# Altium schematic sheet Connectors.SchDoc: Gimbal - Connectors
size Letter; DrawnBy: Jing Hao Yao & Aidan Gratton; Organization: UW Robotics; Address1: 200 University Avenue; Address2: Waterloo; Address3: Ontario; Address4: Canada N2L 3G6; SheetNumber: 3; SheetTotal: 5
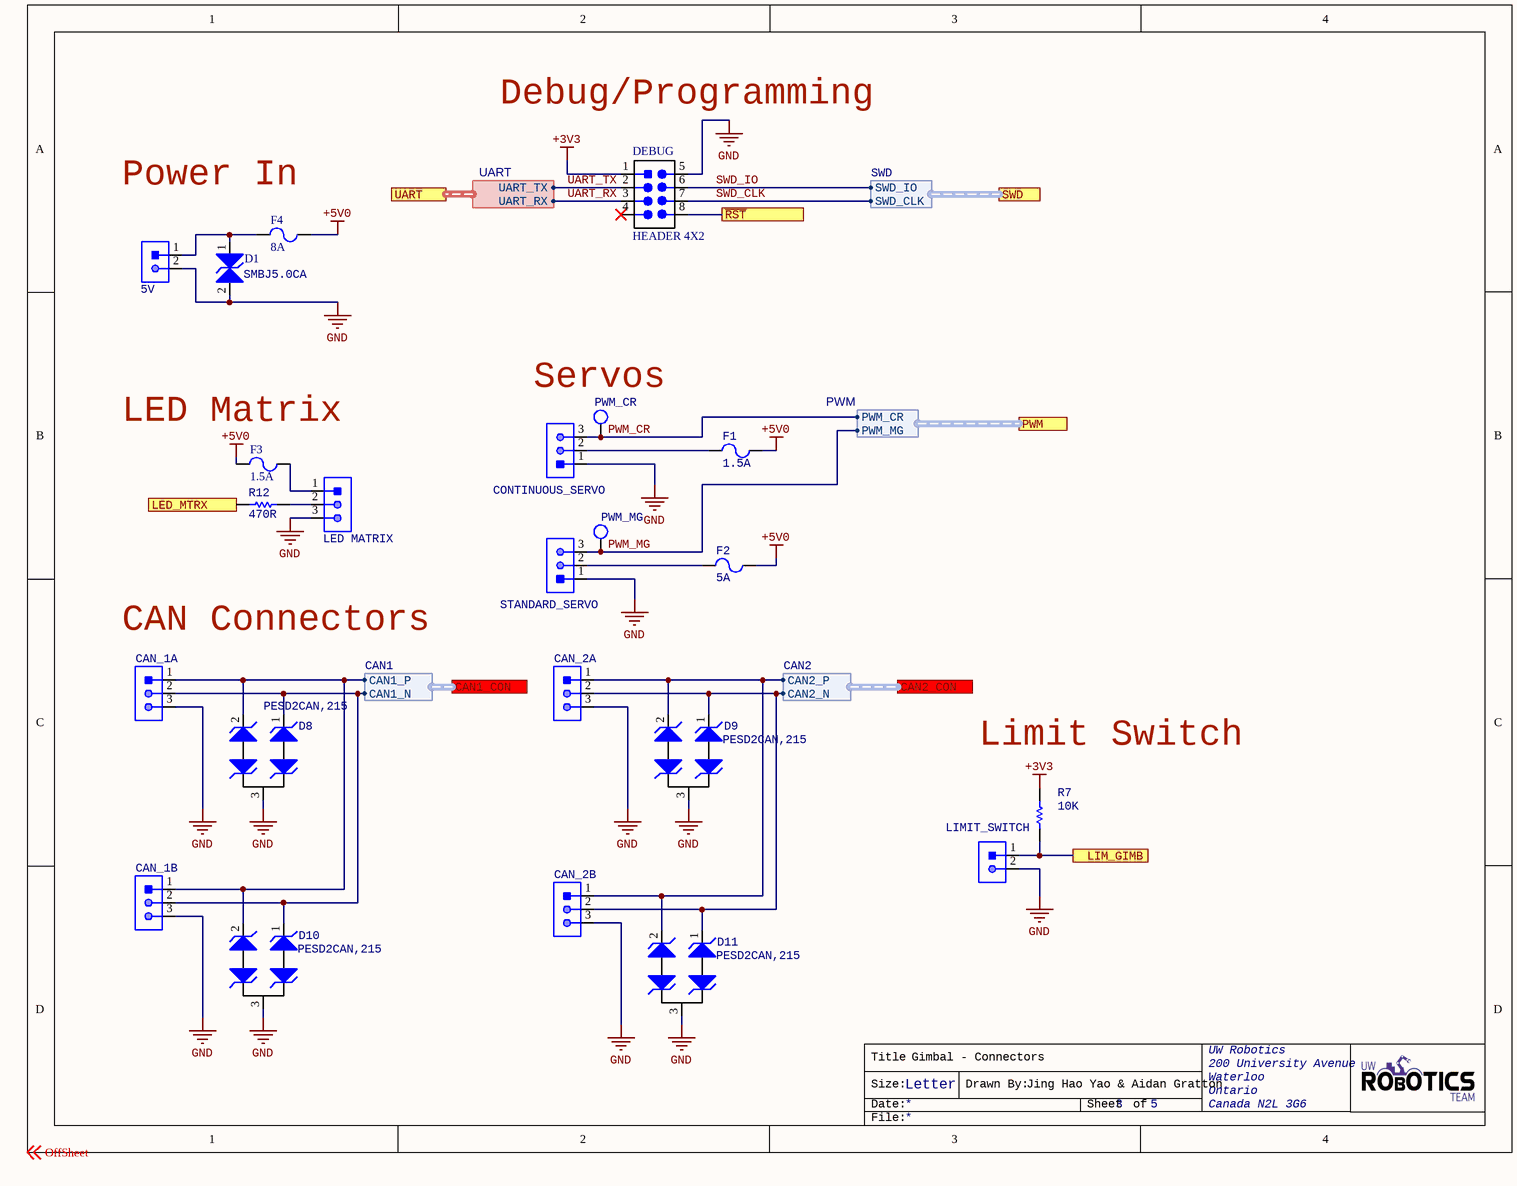
[diagram p0: Connectors.SchDoc]

## Parts
5V  CON_2M_SM4  [JST-B2B-SM4-TB]  (value not drawn)
CAN_1A  CON_3M_SM4  [JST-B3B-SM4-TB]  (value not drawn)
CAN_1B  CON_3M_SM4  [JST-B3B-SM4-TB]  (value not drawn)
CAN_2A  CON_3M_SM4  [JST-B3B-SM4-TB]  (value not drawn)
CAN_2B  CON_3M_SM4  [JST-B3B-SM4-TB]  (value not drawn)
CONTINUOUS_SERVO  CON_3M_SM4  [JST-B3B-SM4-TB]  (value not drawn)
D1  Manufacturer Part Number 1: SMBJ5.0CA  [TVS_DIODE_BIDIRECTIONAL]  (hidden comment: TVS_DIODE_BIDIRECTIONAL)
D8  Manufacturer Part Number: PESD2CAN,215  [TVS_DIODE_CAN]  (hidden comment: TVS_DIODE_CAN)
D9  Manufacturer Part Number: PESD2CAN,215  [TVS_DIODE_CAN]  (hidden comment: TVS_DIODE_CAN)
D10  Manufacturer Part Number: PESD2CAN,215  [TVS_DIODE_CAN]  (hidden comment: TVS_DIODE_CAN)
D11  Manufacturer Part Number: PESD2CAN,215  [TVS_DIODE_CAN]  (hidden comment: TVS_DIODE_CAN)
DEBUG  HEADER 4X2  [HEADER_2X4]
F1  Current Rating: 1.5A  [FUSE_0603]  (hidden comment: FUSE_1.5A_0603)
F2  Current Rating: 5A  [FUSE_0603]  (hidden comment: FUSE_5A_0603)
F3  Current Rating: 1.5A  [FUSE_0603]  (hidden comment: FUSE_1.5A_0603)
F4  Current Rating: 8A  [FUSE_0603]  (hidden comment: FUSE_8A_0603)
LED_MATRIX  CON_3M_SM4  [JST-B3B-SM4-TB]  (value not drawn)
LIMIT_SWITCH  CON_2M_SM4  [JST-B2B-SM4-TB]  (value not drawn)
PWM_CR  TESTPOINT_LOOP  [TESTPOINT_LOOP]  (value not drawn)
PWM_MG  TESTPOINT_LOOP  [TESTPOINT_LOOP]  (value not drawn)
R7  value 10K  [RESC0603(1608)_N]  (hidden comment: RES_10K_0603)
R12  value 470R  [RESC0603(1608)_N]  (hidden comment: 470R 1%)
STANDARD_SERVO  CON_3M_SM4  [JST-B3B-SM4-TB]  (value not drawn)

## Ports
CAN1_CON (harness CAN1), CAN2_CON (harness CAN2), LED_MTRX, LIM_GIMB, PWM (harness PWM), SWD (harness SWD), UART (harness UART), ~{RST}

## Harnesses
UART: UART_RX, UART_TX
CAN2: CAN2_P, CAN2_N
CAN1: CAN1_P, CAN1_N
PWM: PWM_CR, PWM_MG
SWD: SWD_CLK, SWD_IO

## Nets
+3V3: DEBUG.1(VCC) R7.2
+5V0: F1.2 F2.2 F3.1 F4.2
GND: 5V.2 CAN_1A.3 CAN_1B.3 CAN_2A.3 CAN_2B.3 CONTINUOUS_SERVO.1 D1.2 D8.3 D9.3 D10.3 D11.3 DEBUG.5(GND) LED_MATRIX.3 LIMIT_SWITCH.2 STANDARD_SERVO.1
~{RST}: DEBUG.8 ; port ~{RST}
LED_MTRX: R12.1 ; port LED_MTRX
LIM_GIMB: LIMIT_SWITCH.1 R7.1 ; port LIM_GIMB
PWM_CR: CONTINUOUS_SERVO.3 PWM_CR.1 ; port PWM.PWM_CR
PWM_MG: PWM_MG.1 STANDARD_SERVO.3 ; port PWM.PWM_MG
SWD_CLK: DEBUG.7 ; port SWD.SWD_CLK
SWD_IO: DEBUG.6 ; port SWD.SWD_IO
UART_RX: DEBUG.3 ; port UART.UART_RX
UART_TX: DEBUG.2 ; port UART.UART_TX
Net5V_1: 5V.1 D1.1 F4.1
NetCAN_1A_1: CAN_1A.1 CAN_1B.1 D8.2 D10.2 ; port CAN1_CON.CAN1_P
NetCAN_1A_2: CAN_1A.2 CAN_1B.2 D8.1 D10.1 ; port CAN1_CON.CAN1_N
NetCAN_2A_1: CAN_2A.1 CAN_2B.1 D9.2 D11.2 ; port CAN2_CON.CAN2_P
NetCAN_2A_2: CAN_2A.2 CAN_2B.2 D9.1 D11.1 ; port CAN2_CON.CAN2_N
NetCONTINUOUS_SERVO_2: CONTINUOUS_SERVO.2 F1.1
NetF2_1: F2.1 STANDARD_SERVO.2
NetF3_2: F3.2 LED_MATRIX.1
NetLED_MATRIX_2: LED_MATRIX.2 R12.2

Not connected (* = marked no-connect by the designer): DEBUG 4*

## Notes on the sheet
- Debug/Programming
- Power In
- (near F3) LED Matrix
- Servos
- (near CAN_1A) CAN Connectors
- (near R7) Limit Switch
- Labels drawn without touching a wire or pin: OffSheet
- Title
- Size:
- Date:
- Letter
- Drawn By:
- Sheet
- of
- File:

## Library data of the parts
5V LIMIT_SWITCH = CON_2M_SM4: Manufacturer: JST; Manufacturer Part Number: B2B-PH-SM4-TB(LF)(SN); Max Current Rating: 2A; Max Voltage Rating: 100V; Pitch: 2mm; Supplier 1: Digi-Key; Supplier Part Number 1: 455-1734-1-ND; ComponentLink1URL: https://datasheet.ciiva.com/11748/0900766b80ddea81-11748001.pdf?src-supplier=RSComponents; ComponentLink1Description: https://datasheet.ciiva.com/11748/0900766b80ddea81-11748001.pdf?src-supplier=RSComponents; ComponentLink2URL: https://datasheet.ciiva.com/16216/b2b-ph-sm4-tblfsn-16216102.pdf?src-supplier=Future+Electronics; ComponentLink2Description: https://datasheet.ciiva.com/16216/b2b-ph-sm4-tblfsn-16216102.pdf?src-supplier=Future+Electronics; ComponentLink3URL: https://datasheet.ciiva.com/8052/80567-8052023.pdf?src-supplier=Element14; ComponentLink3Description: https://datasheet.ciiva.com/8052/80567-8052023.pdf?src-supplier=Element14; ComponentLink4URL: https://datasheet.ciiva.com/712/eph-712504.pdf?src-supplier=Digi-Key; ComponentLink4Description: https://datasheet.ciiva.com/712/eph-712504.pdf?src-supplier=Digi-Key; ComponentLink5URL: https://datasheet.ciiva.com/712/eph-712505.pdf?src-supplier=Digi-Key; ComponentLink5Description: https://datasheet.ciiva.com/712/eph-712505.pdf?src-supplier=Digi-Key; ComponentLink6URL: https://datasheet.ciiva.com/712/eph-712506.pdf?src-supplier=Digi-Key; ComponentLink6Description: https://datasheet.ciiva.com/712/eph-712506.pdf?src-supplier=Digi-Key
CAN_1A CAN_1B CAN_2A CAN_2B CONTINUOUS_SERVO LED_MATRIX STANDARD_SERVO = CON_3M_SM4: Manufacturer: JST; Manufacturer Part Number: B3B-PH-SM4-TB(LF)(SN); Max Current Rating: 2A; Max Voltage Rating: 100V; Pitch: 2mm; Supplier 1: Digi-Key; Supplier Part Number 1: 455-1735-1-ND; ComponentLink1URL: https://datasheet.ciiva.com/11747/0900766b80ddea81-11747684.pdf?src-supplier=RSComponents; ComponentLink1Description: https://datasheet.ciiva.com/11747/0900766b80ddea81-11747684.pdf?src-supplier=RSComponents
D1 = TVS_DIODE_BIDIRECTIONAL: TVS DIODE 5V 9.2V DO214AA; Manufacturer: Nexperia USA Inc.; Manufacturer 1: Littelfuse; Max Surge Current: 65.3A; Reverse Breakdown Voltage: 6.4V; Number of Elements: 1; Peak Pulse Power: 600W; Power Line Protection: No; Max Breakdown Voltage: 7V; Test Current: 10mA; ESD Protection: Yes; Max Reverse Leakage Current: 1.6mA; Max Power Dissipation: 5W; Element Configuration: Single; Package: SC-70, SOT-323; ComponentLink1Description: Datasheet; ComponentLink1URL: https://www.littelfuse.com/~/media/electronics/datasheets/tvs_diodes/littelfuse_tvs_diode_smbj_datasheet.pdf.pdf; Supplier Part Number 1: SMBJ5.0CALFCT-ND; Supplier 1: Digi-Key; Stock 1: 23233; Pricing 1: 1=0.39000, 10=0.31300, 25=0.28640, 100=0.17980, 250=0.17784, 500=0.16650, 1000=0.11322 (USD); Mount: Surface Mount; Case/Package: SMB; Number of Pins: 2; Min Operating Temperature: -65°C; Max Operating Temperature: 150°C; Direction: Bidirectional; Package Quantity: 3000; Packaging: Tape and Reel; Operating Supply Voltage: 5V; Number of Bidirectional Channels: 1; Reverse Standoff Voltage: 5V; Min Breakdown Voltage: 6.4V; Clamping Voltage: 9.2V; Breakdown Voltage: 6.4V; Number of Channels: 1; Polarity: Bidirectional; Power Dissipation: 600W; Peak Pulse Current: 65.3A; Leakage Current: 1.6mA; Voltage Rating (DC): 5V; Composition: Zener; Length: 0.179inch; Height: 0.096inch; Width: 0.155inch; Radiation Hardening: No; REACH SVHC: No SVHC; Lead Free: Lead Free
D8-D11 = TVS_DIODE_CAN: TVS DIODE 24V 41V SOT323-3; Manufacturer: Nexperia USA Inc.; Package: SC-70, SOT-323; ComponentLink1Description: Datasheet; ComponentLink1URL: https://assets.nexperia.com/documents/data-sheet/PESD1CAN-U.pdf; Supplier Part Number 1: 1727-3891-1-ND; Supplier 1: Digi-Key
DEBUG = HEADER 4X2: CONN HEADER VERT 8POS 2.54MM; Manufacturer Part Number 1: M20-9980445; Manufacturer 1: Harwin Inc.; Supplier Part Number 1: 952-2122-ND; Supplier 1: Digi-Key
F1 F3 = FUSE_1.5A_0603: FUSE SMD 1.5A 32V; ComponentLink1URL: https://datasheet.ciiva.com/26890/getdatasheetpartid-721713-26890390.pdf?src-supplier=Verical; ComponentLink1Description: https://datasheet.ciiva.com/26890/getdatasheetpartid-721713-26890390.pdf?src-supplier=Verical; ComponentLink2URL: https://datasheet.ciiva.com/7464/467-7464069.pdf?src-supplier=Digi-Key; ComponentLink2Description: https://datasheet.ciiva.com/7464/467-7464069.pdf?src-supplier=Digi-Key; ComponentLink3URL: https://datasheet.ciiva.com/7464/467-7464072.pdf?src-supplier=Digi-Key; ComponentLink3Description: https://datasheet.ciiva.com/7464/467-7464072.pdf?src-supplier=Digi-Key; Mount: Surface Mount; Voltage Rating (AC): 32V; Voltage Rating (DC): 32V; Supplier 1: Digi-Key; Supplier Part Number 1: F5702CT-ND; Supplier Packaging 1: Cut Tape
F2 = FUSE_5A_0603: FUSE SMD 5A 32V; Manufacturer 1: Littelfuse; Manufacturer Part Number 1: 0467005.NR; DC Cold Resistance: 8.9mR; Power Dissipation: 363.5mW; Fuse Type: Board Mount (Cartridge Style Excluded); Resistance: 9mR; Approvals: UL,CSA; Supplier 1: Digi-Key; Stock 1: 10729; Pricing 1: 1=1.20000, 5=1.16600, 10=1.09100, 50=0.90280, 100=0.75240, 250=0.73360, 500=0.62074, 1000=0.54549 (USD); RoHS: Yes; Mount: Surface Mount; Case/Package: 0603; Number of Pins: 2; Case Code (Metric): 1608; Case Code (Imperial): 0603; Min Operating Temperature: -55°C; Max Operating Temperature: 90°C; Voltage Rating (AC): 32V; Voltage Rating (DC): 32V; Packaging: Tape and Reel; Package Quantity: 5000; Composition: Thin Film; Fuse Current: 5A; Working Voltage: 32V; Length: 1.6mm; Height: 0.012inch; Width: 0.813mm; Depth: 0.81mm; Radiation Hardening: No; REACH SVHC: Unknown; Lead Free: Lead Free; ComponentLink1URL: https://datasheet.ciiva.com/26923/getdatasheetpartid-763340-26923403.pdf?src-supplier=Verical; ComponentLink1Description: https://datasheet.ciiva.com/26923/getdatasheetpartid-763340-26923403.pdf?src-supplier=Verical; ComponentLink2URL: https://datasheet.ciiva.com/1682/48494-1682052.pdf?src-supplier=Farnell; ComponentLink2Description: https://datasheet.ciiva.com/1682/48494-1682052.pdf?src-supplier=Farnell; ComponentLink3URL: https://datasheet.ciiva.com/299/467-299366.pdf?src-supplier=Digi-Key; ComponentLink3Description: https://datasheet.ciiva.com/299/467-299366.pdf?src-supplier=Digi-Key; ComponentLink4URL: https://datasheet.ciiva.com/1549/48494-1549727.pdf?src-supplier=Element14; ComponentLink4Description: https://datasheet.ciiva.com/1549/48494-1549727.pdf?src-supplier=Element14; ComponentLink5URL: https://datasheet.ciiva.com/299/467-299367.pdf?src-supplier=Digi-Key; ComponentLink5Description: https://datasheet.ciiva.com/299/467-299367.pdf?src-supplier=Digi-Key; ComponentLink6URL: https://datasheet.ciiva.com/299/467-299368.pdf?src-supplier=Digi-Key; ComponentLink6Description: https://datasheet.ciiva.com/299/467-299368.pdf?src-supplier=Digi-Key; ComponentLink7URL: https://datasheet.ciiva.com/16291/467-16291097.pdf?src-supplier=Future+Electronics; ComponentLink7Description: https://datasheet.ciiva.com/16291/467-16291097.pdf?src-supplier=Future+Electronics; Supplier Part Number 1: F1402CT-ND
F4 = FUSE_8A_0603: FUSE SMD 8A 63V; Voltage Rating (AC): 32V; Supplier 1: Digi-Key; Mount: Surface mount; Voltage Rating (DC): 63V; Supplier Packaging 1: Cut Tape; Parameter 1: *; Supplier Part Number 1: 507-2160-1-ND
PWM_CR PWM_MG = TESTPOINT_LOOP: Loop testpoint through-hole pad; Manufacturer: Keystone Electronics; Manufacturer Part Number 1: 5002; Supplier Part Number 1: 36-5002-ND; Supplier 1: Digi-Key
R7 = RES_10K_0603: RES SMD 10K OHM 5% 1/10W 0603; Manufacturer: Yageo; MPN: RC0603JR-0710KL; Package: 0603 (1608 Metric); Dimensions: 0.063" L x 0.031" W (1.60mm x 0.80mm); Tolerance: 5%; Supplier Part Number 1: 311-10KGRCT-ND; Supplier 1: Digi-Key
R12 = RES_470R_0603: RES SMD 470 OHM 1% 1/10W 0603; Manufacturer: Yageo; MPN: AC0603FR-07470RL; Package: 0603 (1608 Metric); Dimensions: 0.063" L x 0.031" W (1.60mm x 0.80mm); Tolerance: 1%; Supplier Part Number 1: 311-470LDCT-ND; Supplier 1: Digi-Key